# Altium schematic sheet VoltageRegulators.SchDoc
size A; SheetNumber: 2; SheetTotal: 5
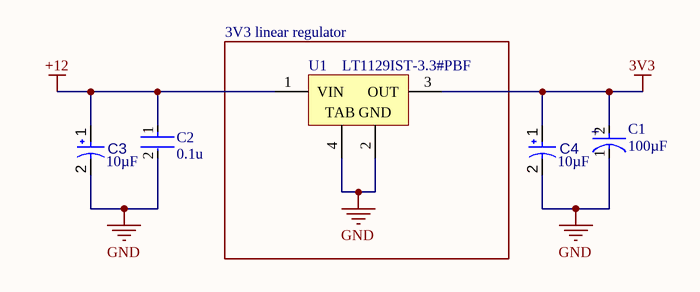
[diagram p0: VoltageRegulators.SchDoc]

## Parts
C1  100µF  [FP-T491X107K025AT-MFG]
C2  0.1u  [FP-C0603C-CF-MFG]
C3  value 10µF  [CAPMP3217X18-T_V]  (hidden comment: TAJA106K016RNJ)
C4  value 10µF  [CAPMP3217X18-T_V]  (hidden comment: TAJA106K016RNJ)
U1  LT1129IST-3.3#PBF  [LT-ST-3-SOT-223_L]

## Blocks framed on the sheet
3V3 linear regulator: U1

## Nets
3V3: C1.2(A) C4.1 U1.3(OUT)
+12: C2.1 C3.1 U1.1(VIN)
GND: C1.1(C) C2.2 C3.2 C4.2 U1.2(GND) U1.4(TAB)

## Notes on the sheet
- (in symbol CMP-2000-07204-2) +

## Library data of the parts
C1 = CMP-2000-07204-2: CAP TANT 100UF 10% 25V 2917; Leakage Current: 25uA; Ripple Current: 742mA; Polarity: Polar; Dissipation Factor: 8%; Life (Hours): 2000Hour; Dielectric Material: Tantalum; ESR (Equivalent Series Resistance): 300mR; Length: 7.3mm; RoHS Compliant: No; Failure Rate: 0.001%; REACH SVHC: No SVHC; Tolerance: 10%; Mount: Surface Mount; Height - Seated (Max): 0.169inch; Features: General Purpose; Height: 4mm; Package Quantity: 1; Case Code (Metric): 7343; Max Operating Temperature: 125°C; Number of Pins: 2; Radiation Hardening: No; Lead Free: Lead Free; Capacitance: 100uF; Termination: SMD/SMT; Voltage Rating: 25V; Series: T491; Depth: 4.3mm; Construction: Flat; Case/Package: 2917; Min Operating Temperature: -55°C; Voltage Rating (DC): 25V; Width: 4.3mm; Packaging: Tape and Reel; Case Code (Imperial): 2917; Voltage: 25V
C2 = CMP-2006-03061-2: CAP CER 0.1UF 50V X7R 0603; Manufacturer: KEMET; Manufacturer Part Number: C0603C104K5RACTU; Tolerance: 0.1; Temperature Coefficient: 30ppm/°C; Material: Ceramic; Automotive Grade: Grade 1; Value: 0.10 μF; Temperature: -55°C to +125°C; RoHS: TRUE; Temperature Range High: +125°C; Lead Free: Yes; Octopart: https://octopart.com/c0603c104k5ractu-kemet-139244; Digikey Description: CAP CER 0.1UF 50V X7R 0603; Category: Cap; Package: C0603C-CF; ComponentLink2Description: Datasheet; Temperature Range Low: -55°C; Device Class L1: Passive Components; Voltage Rating: 50 V; Automotive: Yes; Device Class L3: Ceramic Capacitors; ComponentLink2URL: https://api.kemet.com/component-edge/download/datasheet/C0603C100J5GACAUTO.pdf; Capacitance: 0.10 μF; Device Class L2: Capacitors; Temperature Characteristic: X7R; Height: 0.87mm
C3 C4 = CMP-001-00041-6: Standard Tantalum, 10 uF, +/- 10%, 16 V, -55 to 125 degC, 1206 (3216 Metric), RoHS, Tape and Reel; Manufacturer: AVX; Voltage Rating: 16V; ESR: 3Ohm; RoHS Compliant: True; Tolerance: 10%; Mounting Technology: SM; Min Operating Temperature: -55°C; Capacitor Type: Tantalum; Max Operating Temperature: 125°C; Case/Package: 1206; Pins: 2; Datasheet URL: http://datasheets.avx.com/TAJ.pdf; Datasheet Version: Feb-16; Manufacturer URL: http://www.avx.com/; Package Description: 2-Pin Surface Mount Device, Body 3.2 x 1.65 mm; Package Quantity: 1; Package Reference: CAPMP3217X18-T; Package URL: http://www.avx.com/download/software/literature/AVX-Footprint-Library.pdf; Packaging: TapeandReel
U1 = CMP-0476-01834-1: Micropower Low Dropout Regulator with Shutdown, 4.15 to 30 V Vin, 3.3 V Vout, 3-pin SOT223 (ST-3), -40 to 125 degC, Pb-Free; Manufacturer: Linear Technology; Vin Min(V): 4.15; Iout(mA): 700; Number of Outputs: 1; Vin Max(V): 30; Dropout Voltage(V): 0.45; PSRR(dB): 64; Discrete Pass Element: no; Shutdown Current(uA): 16; Output Voltage: 3.3 V; Isupply(mA): 0.05; RoHS: TRUE; PartNumber: LT1129IST-3.3#PBF; ComponentLink3URL: http://cds.linear.com/docs/en/packaging/SOT_3_05-08-1630.pdf; PackageReference: ST-3; ComponentLink3Description: Package Specification; PackageDescription: 3-Pin Plastic SOT-223, 3.505 x 6.505 mm Body, Pitch 2.3 mm; Mounting Technology: Surface Mount; DatasheetVersion: Rev. F; ComponentLink2URL: http://cds.linear.com/docs/en/datasheet/112935ff.pdf; ComponentLink1URL: http://www.linear.com/; PackageVersion: Jun-10; ComponentLink2Description: Datasheet; ComponentLink1Description: Manufacturer URL